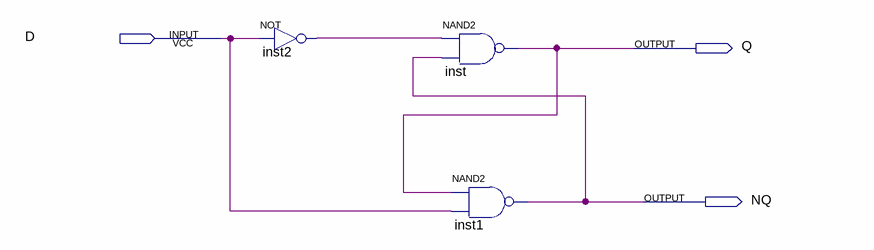
[diagram p0: schematic sheet]
// Quartus schematic latchDNAND.bdf as structural Verilog: 3 symbols, 3 pins
module latchDNAND (
  input  D,
  output Q,
  output NQ
);

  wire inst2_out;

  not inst2 (inst2_out, D);
  nand inst (Q, inst2_out, NQ);
  nand inst1 (NQ, Q, D);
endmodule
